# EAGLE schematic TESTComps (EAGLE 9.4.2)
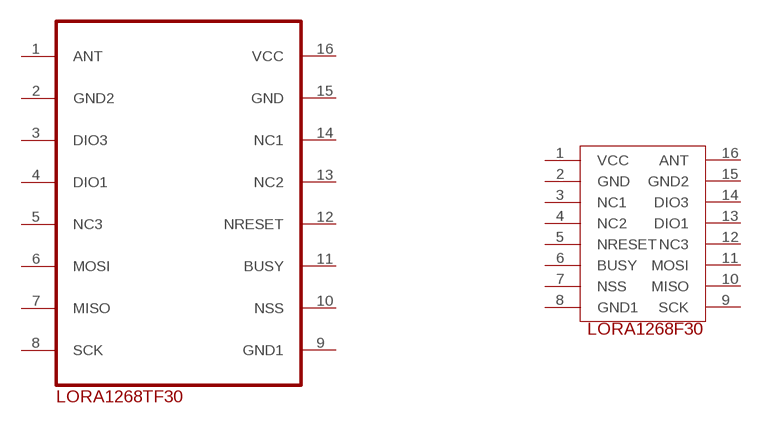
[diagram p0: schematic, sheet 1]

## Parts
U$1  LORA1268TF30  [LORA1268TF30]
U$2  U1  LORA1268F30  [LORA1268F30]
Unconnected: U$1.1(ANT) U$1.2(GND2) U$1.3(DIO3) U$1.4(DIO1) U$1.5(NC3) U$1.6(MOSI) U$1.7(MISO) U$1.8(SCK) U$1.9(GND1) U$1.10(NSS) U$1.11(BUSY) U$1.12(NRESET) U$1.13(NC2) U$1.14(NC1) U$1.15(GND) U$1.16(VCC) U$2.1(VCC) U$2.2(GND) U$2.3(NC1) U$2.4(NC2) U$2.5(NRESET) U$2.6(BUSY) U$2.7(NSS) U$2.8(GND1) U$2.9(SCK) U$2.10(MISO) U$2.11(MOSI) U$2.12(NC3) U$2.13(DIO1) U$2.14(DIO3) U$2.15(GND2) U$2.16(ANT)

## Library data of the parts
U$1 = LORA1268TF30:LORA1268TF30
U$2 = LORA1268f30:LORA1268F30